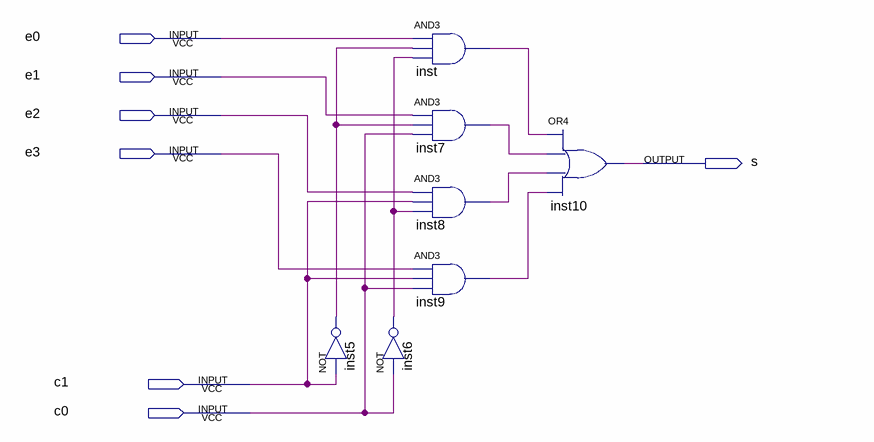
[diagram p0: schematic sheet]
// Quartus schematic jpd_mux_4x1.bdf as structural Verilog: 7 symbols, 7 pins
module jpd_mux_4x1 (
  input  e0,
  input  e1,
  input  e2,
  input  e3,
  input  c1,
  input  c0,
  output s
);

  wire inst5_out, inst6_out, inst7_out, inst8_out, inst9_out, inst_out;

  not inst5 (inst5_out, c1);
  not inst6 (inst6_out, c0);
  and inst (inst_out, e0, inst5_out, inst6_out);
  and inst7 (inst7_out, e1, inst5_out, c0);
  and inst8 (inst8_out, e2, c1, inst6_out);
  and inst9 (inst9_out, e3, c1, c0);
  or inst10 (s, inst_out, inst7_out, inst8_out, inst9_out);
endmodule
